# Altium schematic sheet BOOT.SchDoc
size A2
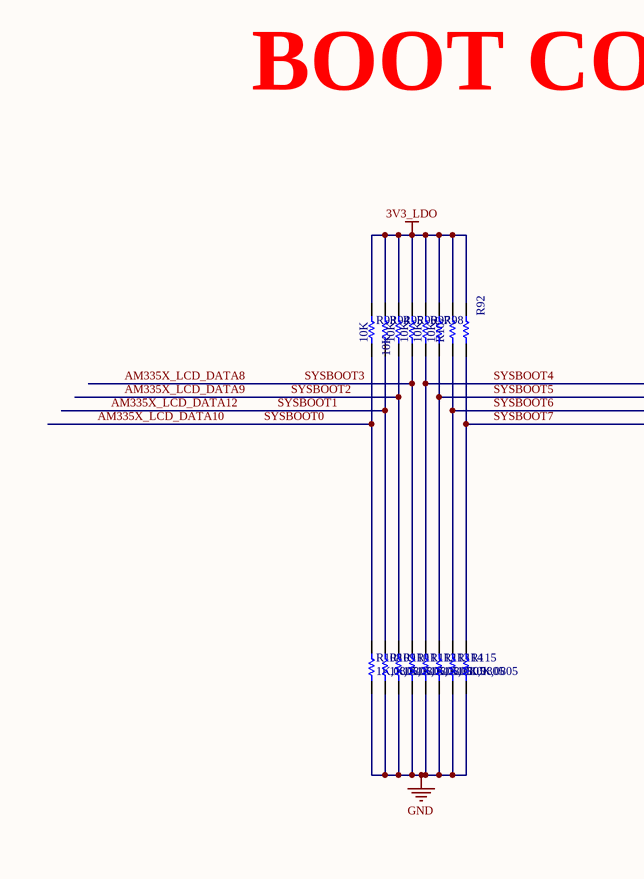
[diagram p0: BOOT.SchDoc, left]
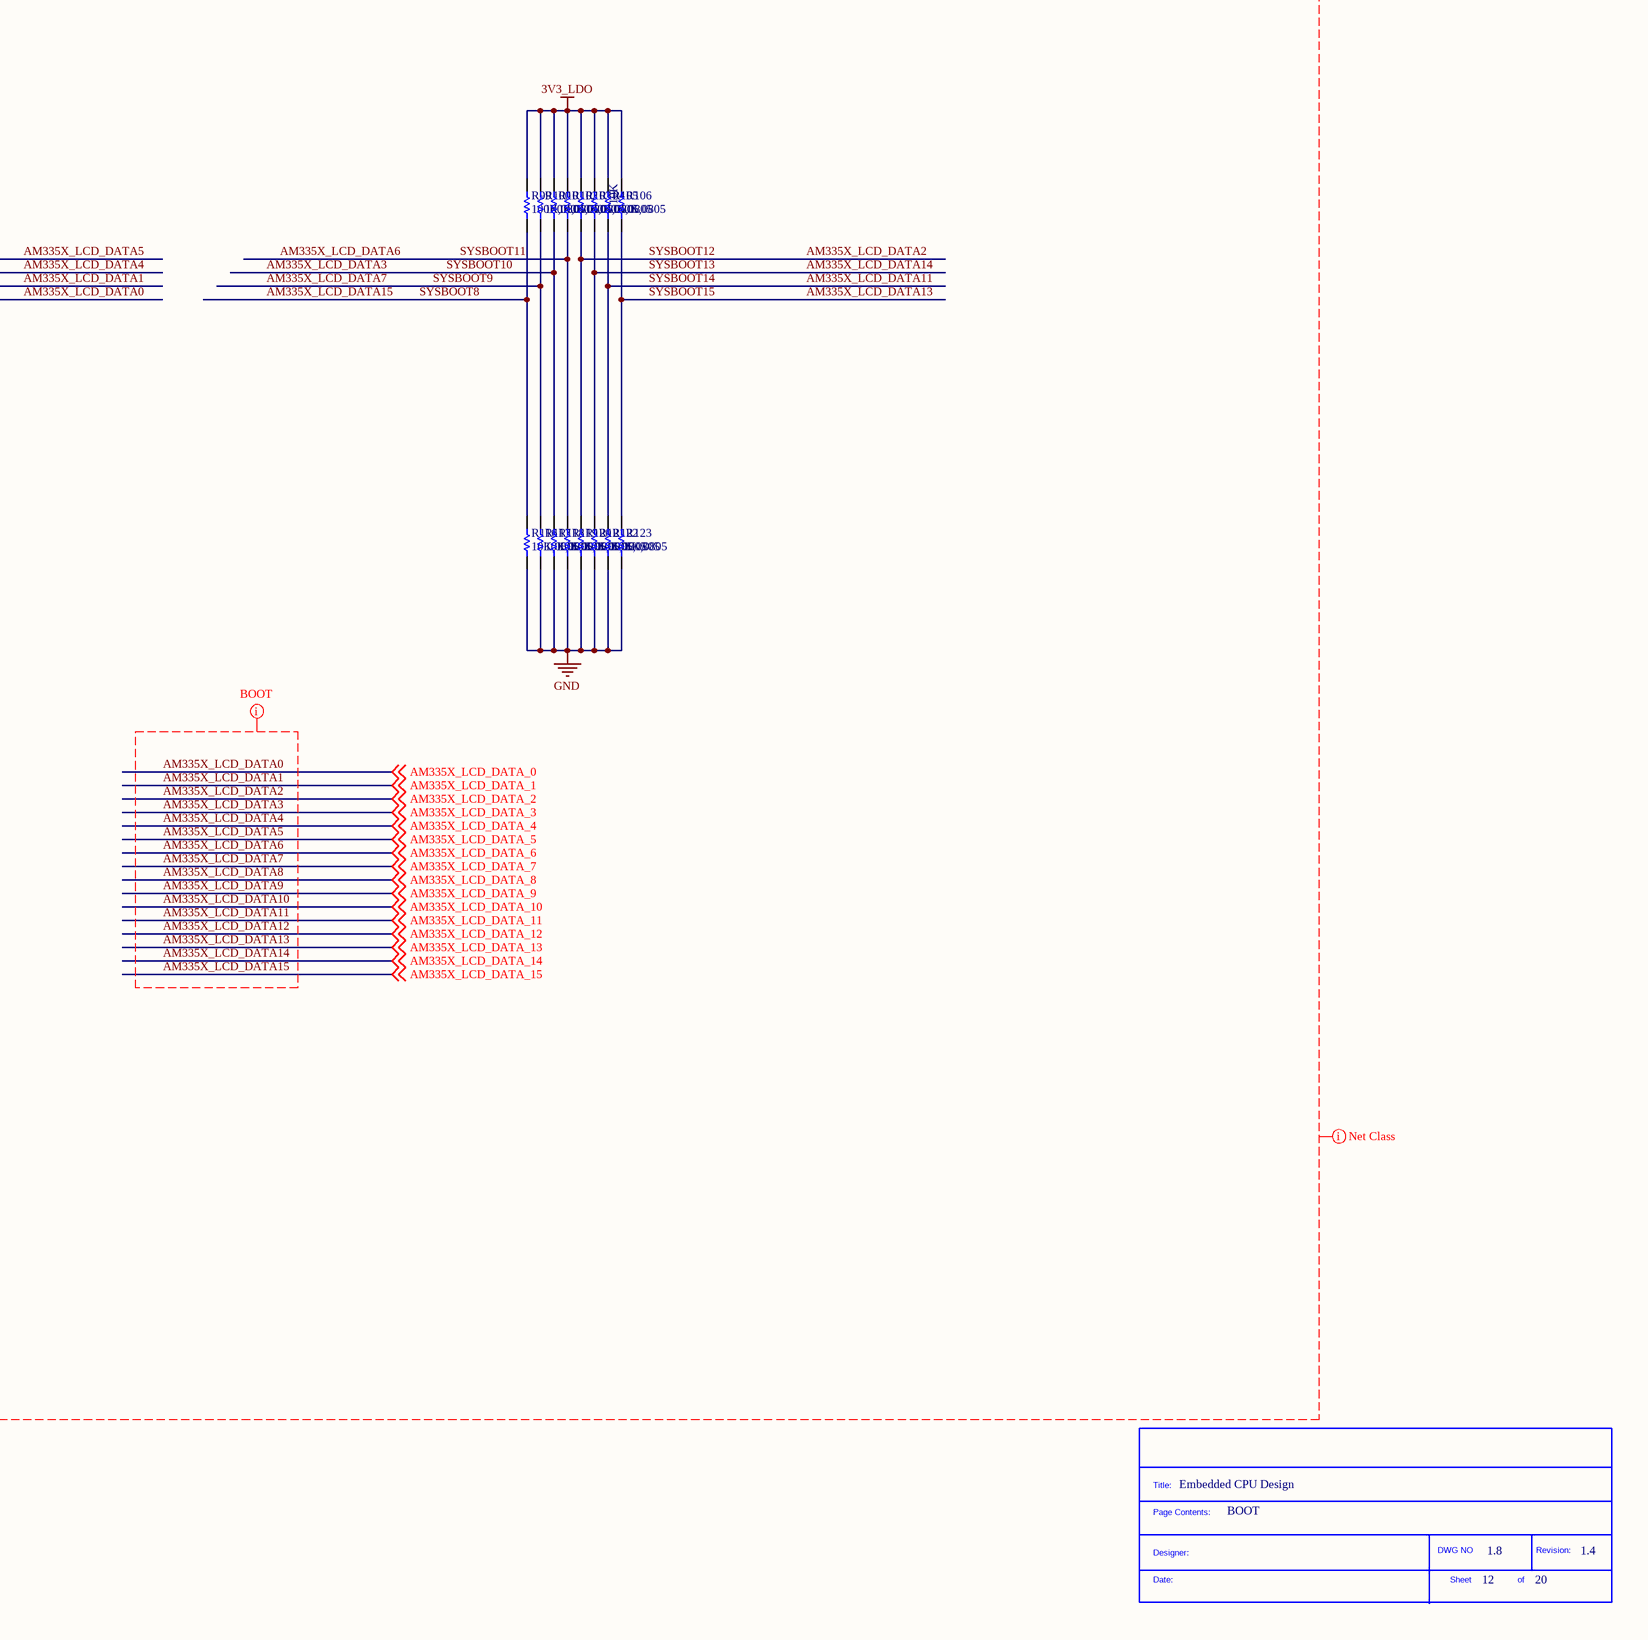
[diagram p1: BOOT.SchDoc, right]

## Parts
*?  SDTitleBlock  (value not drawn)  (graphical)
R92  100K,0805  [0402]  (value not drawn)
R93  10K  [0402]
R94  10K  [0402]
R95  10K  [0402]
R96  10K  [0402]
R97  10K  [0402]
R98  10K  [0402]
R99  100K,0805  [0402]
R100  100K,0805  [0402]
R101  100K,0805  [0402]
R102  100K,0805  [0402]
R103  100K,0805  [0402]
R104  100K,0805  [0402]
R105  100K,0805  [0402]
R106  10K  [0402]
R107  100K,0805  [0402]  (value not drawn)
R108  1K,0805  [0402]
R109  1K,0805  [0402]
R110  1K,0805  [0402]
R111  1K,0805  [0402]
R112  1K,0805  [0402]
R113  1K,0805  [0402]
R114  10K,0805  [0402]
R115  10K,0805  [0402]
R116  10K,0805  [0402]
R117  10K,0805  [0402]
R118  10K,0805  [0402]
R119  10K,0805  [0402]
R120  10K,0805  [0402]
R121  10K,0805  [0402]
R122  10K,0805  [0402]
R123  1K,0805  [0402]

## Nets
3V3_LDO: R92.2 R93.2 R94.2 R95.2 R96.2 R97.2 R98.2 R99.2 R100.2 R101.2 R102.2 R103.2 R104.2 R105.2 R106.2 R107.2
GND: R108.1 R109.1 R110.1 R111.1 R112.1 R113.1 R114.1 R115.1 R116.1 R117.1 R118.1 R119.1 R120.1 R121.1 R122.1 R123.1
AM335X_LCD_DATA0: R107.1 R115.2 ; off-sheet AM335X_LCD_DATA_0  [also labelled AM335X_LCD_DATA_0, SYSBOOT7]
AM335X_LCD_DATA1: R92.1 R114.2 ; off-sheet AM335X_LCD_DATA_1  [also labelled AM335X_LCD_DATA_1, SYSBOOT6]
AM335X_LCD_DATA2: R103.1 R120.2 ; off-sheet AM335X_LCD_DATA_2  [also labelled AM335X_LCD_DATA_2, SYSBOOT12]
AM335X_LCD_DATA3: R101.1 R118.2 ; off-sheet AM335X_LCD_DATA_3  [also labelled AM335X_LCD_DATA_3, SYSBOOT10]
AM335X_LCD_DATA4: R98.1 R113.2 ; off-sheet AM335X_LCD_DATA_4  [also labelled AM335X_LCD_DATA_4, SYSBOOT5]
AM335X_LCD_DATA5: R97.1 R112.2 ; off-sheet AM335X_LCD_DATA_5  [also labelled AM335X_LCD_DATA_5, SYSBOOT4]
AM335X_LCD_DATA6: R102.1 R119.2 ; off-sheet AM335X_LCD_DATA_6  [also labelled AM335X_LCD_DATA_6, SYSBOOT11]
AM335X_LCD_DATA7: R100.1 R117.2 ; off-sheet AM335X_LCD_DATA_7  [also labelled AM335X_LCD_DATA_7, SYSBOOT9]
AM335X_LCD_DATA8: R96.1 R111.2 ; off-sheet AM335X_LCD_DATA_8  [also labelled AM335X_LCD_DATA_8, SYSBOOT3]
AM335X_LCD_DATA9: R95.1 R110.2 ; off-sheet AM335X_LCD_DATA_9  [also labelled AM335X_LCD_DATA_9, SYSBOOT2]
AM335X_LCD_DATA10: R93.1 R108.2 ; off-sheet AM335X_LCD_DATA_10  [also labelled AM335X_LCD_DATA_10, SYSBOOT0]
AM335X_LCD_DATA11: R105.1 R122.2 ; off-sheet AM335X_LCD_DATA_11  [also labelled AM335X_LCD_DATA_11, SYSBOOT14]
AM335X_LCD_DATA12: R94.1 R109.2 ; off-sheet AM335X_LCD_DATA_12  [also labelled AM335X_LCD_DATA_12, SYSBOOT1]
AM335X_LCD_DATA13: R106.1 R123.2 ; off-sheet AM335X_LCD_DATA_13  [also labelled AM335X_LCD_DATA_13, SYSBOOT15]
AM335X_LCD_DATA14: R104.1 R121.2 ; off-sheet AM335X_LCD_DATA_14  [also labelled AM335X_LCD_DATA_14, SYSBOOT13]
AM335X_LCD_DATA15: R99.1 R116.2 ; off-sheet AM335X_LCD_DATA_15  [also labelled AM335X_LCD_DATA_15, SYSBOOT8]

## Layout directives
net class BOOT: AM335X_LCD_DATA0, AM335X_LCD_DATA1, AM335X_LCD_DATA2, AM335X_LCD_DATA3, AM335X_LCD_DATA4, AM335X_LCD_DATA5, AM335X_LCD_DATA6, AM335X_LCD_DATA7, AM335X_LCD_DATA8, AM335X_LCD_DATA9, AM335X_LCD_DATA10, AM335X_LCD_DATA11, AM335X_LCD_DATA12, AM335X_LCD_DATA13, AM335X_LCD_DATA14, AM335X_LCD_DATA15
net class BOOT_P: 3V3_LDO, AM335X_LCD_DATA0, AM335X_LCD_DATA1, AM335X_LCD_DATA2, AM335X_LCD_DATA3, AM335X_LCD_DATA4, AM335X_LCD_DATA5, AM335X_LCD_DATA6, AM335X_LCD_DATA7, AM335X_LCD_DATA8, AM335X_LCD_DATA9, AM335X_LCD_DATA10, AM335X_LCD_DATA11, AM335X_LCD_DATA12, AM335X_LCD_DATA13, AM335X_LCD_DATA14, AM335X_LCD_DATA15, AM335X_LCD_DATA_0, AM335X_LCD_DATA_1, AM335X_LCD_DATA_2, AM335X_LCD_DATA_3, AM335X_LCD_DATA_4, AM335X_LCD_DATA_5, AM335X_LCD_DATA_6, AM335X_LCD_DATA_7, AM335X_LCD_DATA_8, AM335X_LCD_DATA_9, AM335X_LCD_DATA_10, AM335X_LCD_DATA_11, AM335X_LCD_DATA_12, AM335X_LCD_DATA_13, AM335X_LCD_DATA_14, AM335X_LCD_DATA_15, GND, SYSBOOT0, SYSBOOT1, SYSBOOT2, SYSBOOT3, SYSBOOT4, SYSBOOT5, SYSBOOT6, SYSBOOT7, SYSBOOT8, SYSBOOT9, SYSBOOT10, SYSBOOT11, SYSBOOT12, SYSBOOT13, SYSBOOT14, SYSBOOT15

## Notes on the sheet
- BOOT CONFIGURATIONS
- Embedded CPU Design
- BOOT
- 12
- 1.8
- 20
- 1.4
- (in symbol SDTitleBlock) Title:; Page Contents:; DWG NO; Revision:; Designer:; Date:; Sheet; of

## Library data of the parts
R92 R99-R105 R107 = 100K,0805: TE CONNECTIVITY / NEOHM - CPF0805B100KE1 - RESISTOR, 0805, 100K; Product Range: TE CONNECTIVITY - CPF Series; Resistance: 100; Resistance Tolerance: ± 0.1%; Resistor Case Style: 0805 [2012 Metric]; Resistor Element Material: Thin Film; Temperature Coefficient: ± 25; Voltage Rating: 200; External Depth: 0.5; External Length / Height: 2; External Width: 1.25; Resistor Mounting: SMD; Tolerance: ±5%; Power (Watts): 0.125W, 1/8W; Supplier 1: Digi-Key; Manufacturer: TE CONNECTIVITY / NEOHM; Manufacturer Part Number: CPF0805B100KE1; RoHS: YES; Stock 1: 923150; Pricing 1: 1=0.1, 50=0.0196, 100=0.0149, 250=0.01104, 500=0.00816, 1000=0.00544, 2500=0.00459 (USD); Power Rating: 100; Packaging: Cut Tape; MSL: -; No. of Pins: 2; Operating Temperature Max: 155; Operating Temperature Min: -55; Operating Temperature Range: -55°C to +155; Series: CPF<!--FANDB--><div class="features-and-benefits-container"></div>; ComponentLink1URL: http://www.tycoelectronics.com/commerce/DocumentDelivery/DDEController?Action=srchrtrv&DocNm=1614883&DocType=Customer+Drawing&DocLang=English; ComponentLink1Description: http://www.tycoelectronics.com/commerce/DocumentDelivery/DDEController?Action=srchrtrv&DocNm=1614883&DocType=Customer+Drawing&DocLang=English; ComponentLink2URL: http://www.tycoelectronics.com/commerce/DocumentDelivery/DDEController?Action=srchrtrv&DocNm=1773200&DocType=Data+Sheet&DocLang=English; ComponentLink2Description: http://www.tycoelectronics.com/commerce/DocumentDelivery/DDEController?Action=srchrtrv&DocNm=1773200&DocType=Data+Sheet&DocLang=English; Supplier Part Number 1: P100KACT-ND; Category: Resistors; Resistance (Ohms): 100k; Composition: Thick Film; Features: Automotive AEC-Q200; Operating Temperature: -55°C ~ 155°C; Package / Case: 0805 (2012 Metric); Supplier Device Package: 0805; Size / Dimension: 0.079" L x 0.049" W (2.00mm x 1.25mm); Height: 0.028" (0.70mm); Number of Terminations: 2; ComponentLink3URL: http://industrial.panasonic.com/www-cgi/jvcr13pz.cgi?E+PZ+3+AOA0001+ERJ6GEYJ104V+7+WW; ComponentLink3Description: http://industrial.panasonic.com/www-cgi/jvcr13pz.cgi?E+PZ+3+AOA0001+ERJ6GEYJ104V+7+WW
R93-R98 R106 R114-R122 = 10K,0805: BOURNS - CR0805-FX-1002GLF - RESISTOR, 10K, 0.125W, 1%; Product Range: BOURNS - CR Series; Resistance: 10; Power Rating: 125; Resistor Case Style: 0805 [2012 Metric]; Resistor Element Material: Thick Film; Temperature Coefficient: ± 100; Voltage Rating: 150; SVHC: No SVHC (16-Jun-2014); Resistor Mounting: SMD<!--FANDB--><div class="features-and-benefits-container"></div>; Power (Watts): 0.125W, 1/8W; Manufacturer: BOURNS; Manufacturer Part Number: CR0805-FX-1002GLF; RoHS: YES; Resistance Tolerance: ± 1%; Packaging: Cut Tape; MSL: MSL 1 - Unlimited; ComponentLink1URL: http://www.farnell.com/datasheets/1845293.pdf; ComponentLink1Description: http://www.farnell.com/datasheets/1845293.pdf; Supplier 1: Digi-Key; Category: Resistors; Stock 1: 1116166; Pricing 1: 1=0.1, 10=0.029, 50=0.0162, 100=0.0123, 250=0.00912, 500=0.00672, 1000=0.00448, 2500=0.00378 (USD); Resistance (Ohms): 10k; Tolerance: ±1%; Composition: Thick Film; Features: -; Operating Temperature: -55°C ~ 155°C; Package / Case: 0805 (2012 Metric); Supplier Device Package: 0805; Size / Dimension: 0.079" L x 0.049" W (2.00mm x 1.25mm); Height: 0.026" (0.65mm); Number of Terminations: 2; ComponentLink2URL: http://www.seielect.com/Catalog/SEI-RMCF_RMCP.pdf; ComponentLink2Description: http://www.seielect.com/Catalog/SEI-RMCF_RMCP.pdf; Supplier Part Number 1: RMCF0805FT10K0CT-ND
R108-R113 R123 = 1K,0805: BOURNS - CR0805-FX-1001ELF - RESISTOR, 1K, 0.125W, 1%; Product Range: BOURNS - CR Series; Resistance: 1; Power Rating: 125; Resistor Case Style: 0805 [2012 Metric]; Resistor Element Material: Thick Film; Temperature Coefficient: ± 100; Voltage Rating: 150; SVHC: No SVHC (16-Jun-2014); Resistor Mounting: SMD<!--FANDB--><div class="features-and-benefits-container"></div>; Power (Watts): 0.125W, 1/8W; Supplier 1: Digi-Key; Manufacturer: BOURNS; Manufacturer Part Number: CR0805-FX-1001ELF; RoHS: YES; Stock 1: 2060902; Pricing 1: 1=0.1, 50=0.0288, 100=0.0219, 250=0.01624, 500=0.012, 1000=0.008, 2500=0.00675 (USD); Resistance Tolerance: ± 1%; Packaging: Cut Tape; MSL: MSL 1 - Unlimited; ComponentLink1URL: http://www.farnell.com/datasheets/1845293.pdf; ComponentLink1Description: http://www.farnell.com/datasheets/1845293.pdf; Supplier Part Number 1: P1.00KCCT-ND; Category: Resistors; Resistance (Ohms): 1k; Tolerance: ±1%; Composition: Thick Film; Features: Automotive AEC-Q200; Operating Temperature: -55°C ~ 155°C; Package / Case: 0805 (2012 Metric); Supplier Device Package: 0805; Size / Dimension: 0.079" L x 0.049" W (2.00mm x 1.25mm); Height: 0.028" (0.70mm); Number of Terminations: 2; ComponentLink2URL: http://industrial.panasonic.com/www-cgi/jvcr13pz.cgi?E+PZ+3+AOA0002+ERJ6ENF1001V+7+WW; ComponentLink2Description: http://industrial.panasonic.com/www-cgi/jvcr13pz.cgi?E+PZ+3+AOA0002+ERJ6ENF1001V+7+WW